# EAGLE schematic MIDI Player (EAGLE 9.6.2)
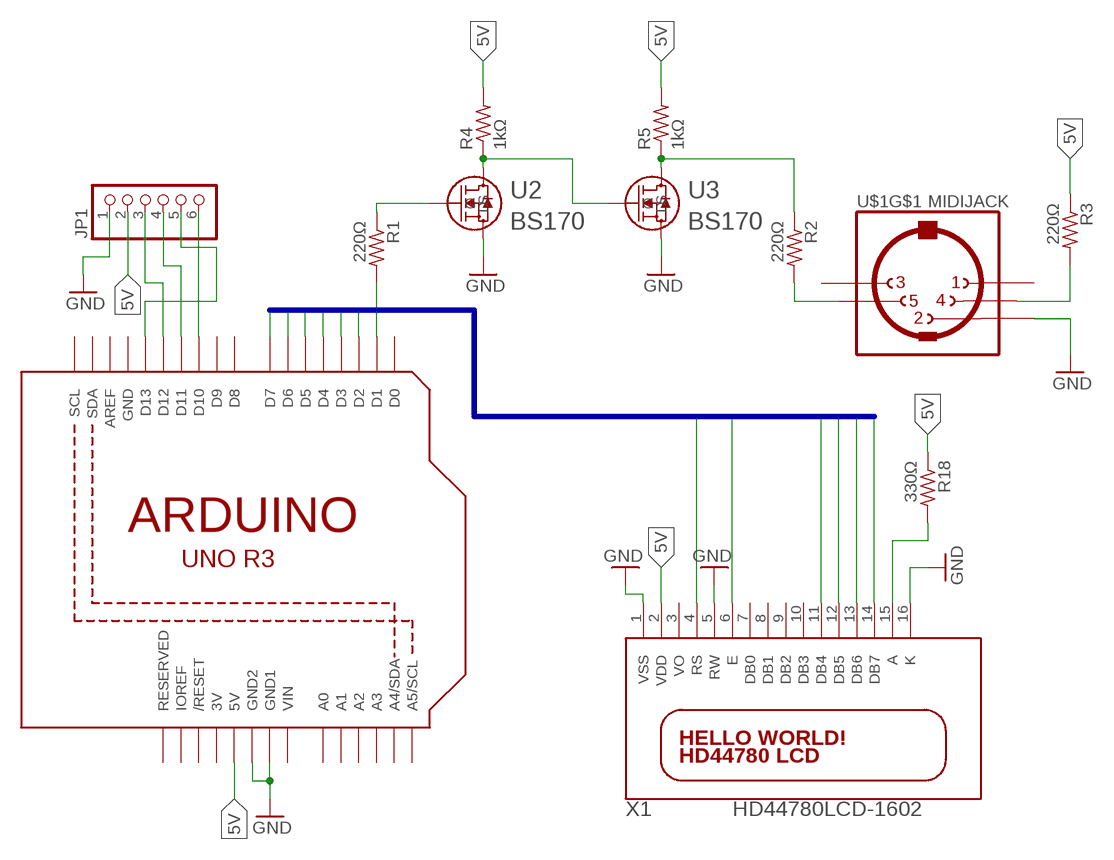
[diagram p0: schematic, sheet 1]

## Parts
JP1  PINHD-1X6B  [1X06-BIG]
R1  220Ω  R-US_0207/10  [0207/10]
R2  220Ω  R-US_0207/10  [0207/10]
R3  220Ω  R-US_0207/10  [0207/10]
R4  1kΩ  R-US_0207/10  [0207/10]
R5  1kΩ  R-US_0207/10  [0207/10]
R18  330Ω  R-US_0207/10  [0207/10]
U1  ARDUINOR3-DIMENSION  [ARDUINOR3]
U2  BS170  [TO_SA06_ONS]
U3  BS170  [TO_SA06_ONS]
U$1  MIDIJACK  [CP-2350]
X1  HD44780LCD-1602  [LCD1602]

## Nets
5V: JP1.2 R3.1 R4.2 R5.2 R18.1 U1.5V X1.2(VDD)
DB4: U1.D5 X1.11(DB4)
DB5: U1.D4 X1.12(DB5)
DB6: U1.D3 X1.13(DB6)
DB7: U1.D2 X1.14(DB7)
E: U1.D6 X1.6(E)
GND: JP1.1 U1.GND1 U1.GND2 U2.3(S) U3.3(S) U$1.2 X1.1(VSS) X1.5(RW) X1.16(K)
N$1: R1.1 U2.2(G)
N$2: R1.2 U1.D1
N$3: R3.2 U$1.4
N$4: R18.2 X1.15(A)
N$5: JP1.6 U1.D10
N$6: JP1.4 U1.D11
N$7: JP1.3 U1.D12
N$9: R2.1 R5.1 U3.1(D)
N$10: R2.2 U$1.5
N$12: JP1.5 U1.D13
N$26: R4.1 U2.1(D) U3.2(G)
RS: U1.D7 X1.4(RS)
Unconnected: U1.A0 U1.A1 U1.A2 U1.A3 U1.A4(A4/SDA) U1.A5(A5/SCL) U1.AREF U1.D0 U1.D8 U1.D9 U1.IOREF U1.RESERVED U1.RESET(/RESET) U1.SCL U1.SDA U$1.1 U$1.3 U$1.PE1(MT) U$1.PE2(MT) U$1.PE(MT) U$1.PE@(MT) X1.3(VO) X1.7(DB0) X1.8(DB1) X1.9(DB2) X1.10(DB3)

## Buses
DB[4..7],E,RS

## Power pins joined to a net without a drawn wire
3V: U1.3V
GND: U1.GND
VIN: U1.VIN

## Library data of the parts
JP1 = adafruit:PINHD-1X6: PIN HEADER
R1-R5 R18 = adafruit:R-US_: RESISTOR, American symbol
U1 = adafruit:ARDUINOR3: This is a new object for the new Arduino R3 - with extra pins that you may want to use (such as IOref, and duplicated A4/A5
U2 U3 = components:BS170: N-Channel enhancement type MOSFET; COPYRIGHT: Copyright (C) 2024 Ultra Librarian. All rights reserved.; MANUFACTURER_PART_NUMBER: BS170; MFR_NAME: onsemi / Fairchild Semiconductor
U$1 = adafruit:MIDIJACK: DIN 5 jack also known as MIDI jack A modification of conn-hirshman:MAB5SH with two options for the grounding 'teeth'
X1 = adafruit:HD44780LCD: HD44780 LCD Standard character type LCDs, available in sizes from 8x1 to 40x4!